# Altium schematic sheet Network.SchDoc: Network
size A4
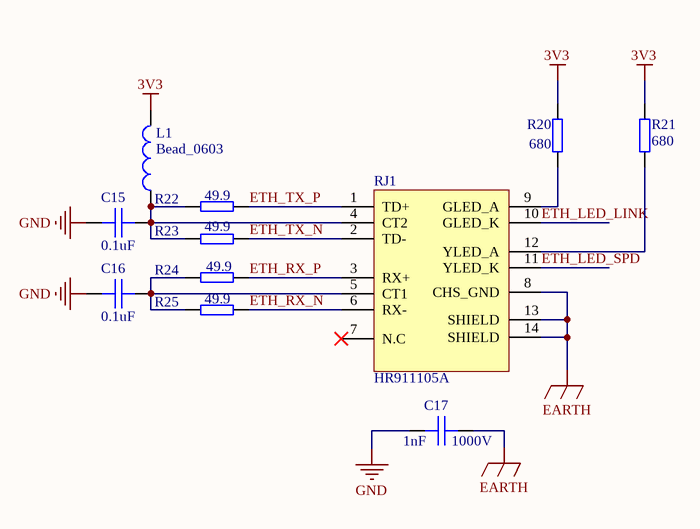
[diagram p0: Network.SchDoc]

## Parts
C15  0.1uF  [CAP-0603]
C16  0.1uF  [CAP-0603]
C17  1nF  voltage: 1000V  [CAP-1206]
L1  Bead_0603  [L-0603]
R20  680  [RES-0603]
R21  680  [RES-0603]
R22  49.9  [RES-0603]
R23  49.9  [RES-0603]
R24  49.9  [RES-0603]
R25  49.9  [RES-0603]
RJ1  HR911105A  [HR911105A]

## Nets
3V3: L1.2 R20.2 R21.1
EARTH: C17.2 RJ1.8(CHS_GND) RJ1.13(SHIELD) RJ1.14(SHIELD)
GND: C15.1 C16.1 C17.1
ETH_LED_LINK: RJ1.10(GLED_K)
ETH_LED_SPD: RJ1.11(YLED_K)
ETH_RX_N: R25.1 RJ1.6(RX-)
ETH_RX_P: R24.1 RJ1.3(RX+)
ETH_TX_N: R23.1 RJ1.2(TD-)
ETH_TX_P: R22.1 RJ1.1(TD+)
NetC15_2: C15.2 L1.1 R22.2 R23.2 RJ1.4(CT2)
NetC16_2: C16.2 R24.2 R25.2 RJ1.5(CT1)
NetR20_1: R20.1 RJ1.9(GLED_A)
NetR21_2: R21.2 RJ1.12(YLED_A)

Not connected (* = marked no-connect by the designer): RJ1 7(N.C)*

## Notes on the sheet
- Title
- Size:
- Date:
- A4
- Number:
- Time:
- Revision:
- Sheet
- of
- File:

## Library data of the parts
C15 C16 = C_0603: 陶瓷贴片电容0603; tolerance: 10%; voltage: 50V; ESR: 1.73mOhm; IRMS: 5.59A; C_value: 0.1uF; Series: X7R
C17 = C_1206: 陶瓷贴片电容1206; tolerance: 10%; C_value: 1nF
L1 = Bead_0603: 贴片磁珠0603; Impedance: 120Ohm; Current: 2A
R20-R25 = R_0603: 贴片电阻0603; tolerance: 5%; voltage: 50V; power: 0.063W
  R20 R21: R_value: 680
  R22-R25: R_value: 49.9
RJ1 = HR911105A: Header, 8-Pin, Dual row; LatestRevisionDate: 17-Jul-2002; LatestRevisionNote: Re-released for DXP Platform.; Publisher: Altium Limited